# Altium schematic sheet MainDuasRodas.SchDoc
size A4
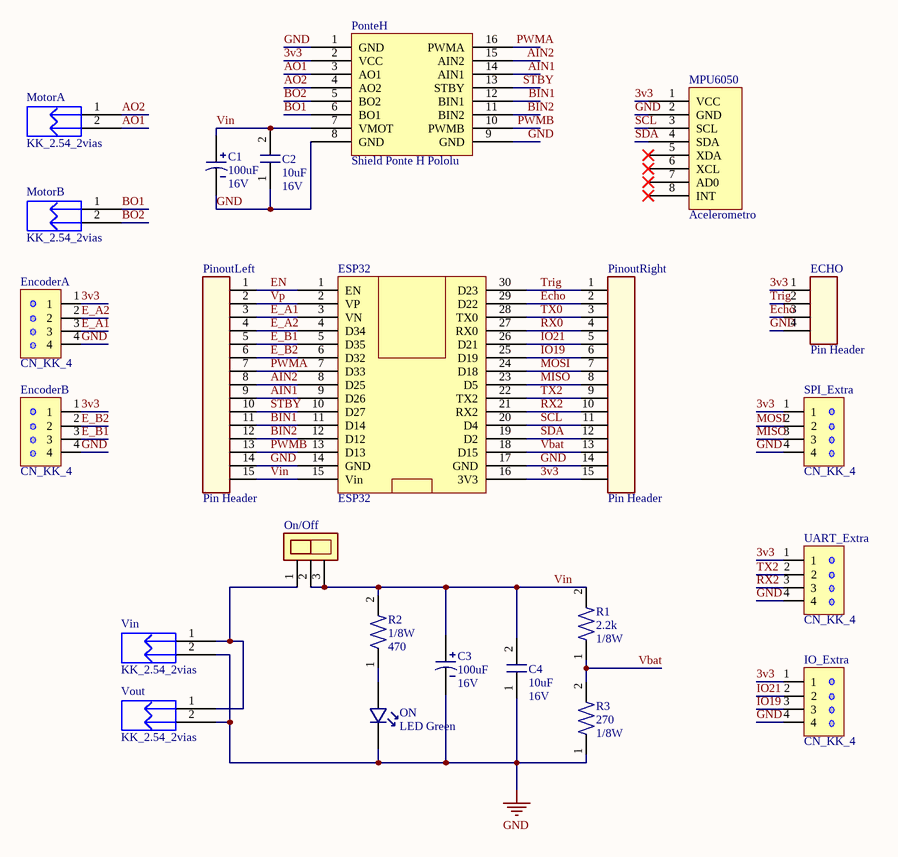
[diagram p0: MainDuasRodas.SchDoc]

## Parts
C1  Capacitance: 100uF  Voltage: 16V  [Cap Elec 100uF/16V]  (hidden comment: Cap Elec 100uF/16V)
C2  Capacitance: 10uF  Voltage: 16V  [CAP 10uF/16V]  (hidden comment: CAP 10uF/16v)
C3  Capacitance: 100uF  Voltage: 16V  [Cap Elec 100uF/16V]  (hidden comment: Cap Elec 100uF/16V)
C4  Capacitance: 10uF  Voltage: 16V  [CAP 10uF/16V]  (hidden comment: CAP 10uF/16v)
ECHO  Pin Header  [Pin Header 4 Ways]
EncoderA  CN_KK_4  [CN_KK_4_5045-4]
EncoderB  CN_KK_4  [CN_KK_4_5045-4]
ESP32  ESP32  [DIP30 - duplicate3]
IO_Extra  CN_KK_4  [CN_KK_4_5045-4]
MotorA  KK_2.54_2vias  [KK_2VIAS_180º]
MotorB  KK_2.54_2vias  [KK_2VIAS_180º]
MPU6050  Acelerometro  [MPU6050]
ON  LED Green  [LED GREEN PTH STAND]
On/Off  SS12D00G4  [SS12D00G4]  (value not drawn)
PinoutLeft  Pin Header  [Pin Header 15 Ways]
PinoutRight  Pin Header  [Pin Header 15 Ways]
PonteH  Shield Ponte H Pololu  [SHIELDMD08AR]
R1  Resistence: 2.2k  Power: 1/8W  [RES SMD 2.2k OHM 1% 1/8W 0805]  (hidden comment: RES 0805)
R2  Power: 1/8W  Resistence: 470  [RES SMD 470OHM 1% 1/8W 0805]  (hidden comment: RES 0805)
R3  Resistence: 270  Power: 1/8W  [RES SMD 270 OHM 1% 1/8W 0805]  (hidden comment: RES 0805)
SPI_Extra  CN_KK_4  [CN_KK_4_5045-4]
UART_Extra  CN_KK_4  [CN_KK_4_5045-4]
Vin  KK_2.54_2vias  [KK_2VIAS_180º]
Vout  KK_2.54_2vias  [KK_2VIAS_180º]

## Nets
GND: C1.1 C2.1 C3.1 C4.1 ECHO.4 EncoderA.4 EncoderB.4 ESP32.14(GND) ESP32.17(GND) IO_Extra.4 MPU6050.2(GND) ON.K PinoutLeft.14 PinoutRight.14 PonteH.1(GND) PonteH.8(GND) PonteH.9(GND) R3.1 SPI_Extra.4 UART_Extra.4 Vin.2 Vout.2
3v3: ECHO.1 EncoderA.1 EncoderB.1 ESP32.16(3V3) IO_Extra.1 MPU6050.1(VCC) PinoutRight.15 PonteH.2(VCC) SPI_Extra.1 UART_Extra.1
AIN1: ESP32.9(D26) PinoutLeft.9 PonteH.14(AIN1)
AIN2: ESP32.8(D25) PinoutLeft.8 PonteH.15(AIN2)
AO1: MotorA.2 PonteH.3(AO1)
AO2: MotorA.1 PonteH.4(AO2)
BIN1: ESP32.11(D14) PinoutLeft.11 PonteH.12(BIN1)
BIN2: ESP32.12(D12) PinoutLeft.12 PonteH.11(BIN2)
BO1: MotorB.1 PonteH.6(BO1)
BO2: MotorB.2 PonteH.5(BO2)
E_A1: EncoderA.3 ESP32.3(VN) PinoutLeft.3
E_A2: EncoderA.2 ESP32.4(D34) PinoutLeft.4
E_B1: EncoderB.3 ESP32.5(D35) PinoutLeft.5
E_B2: EncoderB.2 ESP32.6(D32) PinoutLeft.6
Echo: ECHO.3 ESP32.29(D22) PinoutRight.2
EN: ESP32.1(EN) PinoutLeft.1
IO19: ESP32.25(D19) IO_Extra.3 PinoutRight.6
IO21: ESP32.26(D21) IO_Extra.2 PinoutRight.5
MISO: ESP32.23(D5) PinoutRight.8 SPI_Extra.3
MOSI: ESP32.24(D18) PinoutRight.7 SPI_Extra.2
PWMA: ESP32.7(D33) PinoutLeft.7 PonteH.16(PWMA)
PWMB: ESP32.13(D13) PinoutLeft.13 PonteH.10(PWMB)
RX0: ESP32.27(RX0) PinoutRight.4
RX2: ESP32.21(RX2) PinoutRight.10 UART_Extra.3
SCL: ESP32.20(D4) MPU6050.3(SCL) PinoutRight.11
SDA: ESP32.19(D2) MPU6050.4(SDA) PinoutRight.12
STBY: ESP32.10(D27) PinoutLeft.10 PonteH.13(STBY)
Trig: ECHO.2 ESP32.30(D23) PinoutRight.1
TX0: ESP32.28(TX0) PinoutRight.3
TX2: ESP32.22(TX2) PinoutRight.9 UART_Extra.2
Vbat: ESP32.18(D15) PinoutRight.13 R1.1 R3.2
Vin: C1.2 C2.2 C3.2 C4.2 ESP32.15(Vin) On/Off.2 On/Off.3 PinoutLeft.15 PonteH.7(VMOT) R1.2 R2.2
Vp: ESP32.2(VP) PinoutLeft.2
NetOn/Off_1: On/Off.1 Vin.1 Vout.1
NetON_A: ON.A R2.1

Not connected (* = marked no-connect by the designer): MPU6050 5(XDA)* 6(XCL)* 7(AD0)* 8(INT)*

## Library data of the parts
C1 C3 = Cap Elec 100uF/16V: 100µF 16V Aluminum Electrolytic Capacitors Radial; Manufacturer 1: KEMET; Manufacturer 1 PN: ESK107M016AC3AA; Mouser PN: 80-ESK107M016AC3AA; Digikey PN: 399-6601-ND; ComponentLink1Description: Datasheet; ComponentLink1URL: https://content.kemet.com/datasheets/KEM_A4004_ESK.pdf
C2 C4 = CAP 10uF/16V: 10µF ±10% 16V Ceramic Capacitor X5R 0805 (2012 Metric); Manufacturer 1: Samsung Electro-Mechanics; Manufacturer 1 PN: CL21A106KOQNNWE; ComponentLink1Description: Specification; ComponentLink1URL: http://www.samsungsem.com/kr/support/product-search/mlcc/__icsFiles/afieldfile/2018/07/27/CL21A106KOQNNWE.pdf; Mouser PN: 710-885012107014; Digikey PN: 1276-2894-1-ND
ECHO = Pin Header 4 ways: Connector Header PTH 0.100" (2.54mm); Manufacturer 1: Irwin Inc.; Manufacturer 1 PN: M20-9992046
EncoderA EncoderB IO_Extra SPI_Extra UART_Extra = CN_KK_4: KK_4; Value: ?
MotorA MotorB Vin Vout = KK_2.54_2vias: Conector KK 2.54mm 2 vias; Descrição: Conector KK 3 vias com passo 2.54mm; Encapsulamento: PTH - 180º; Modelo: 2 vias - 180º; Valor: KK 2 vias 180º; Marca: *; Observação: *
MPU6050 = MPU6050
ON = LED Green PTH Stand: Green 527nm LED Indication - Discrete 3.2V Radial; Manufacturer 1: Wurth Electronics Inc.; Manufacturer 1 PN: 151053GS03000; ComponentLink1Description: Datasheet; ComponentLink1URL: https://www.cree.com/led-components/media/documents/C503B-BAS-BAN-BCS-BCN-GAS-GAN-GCS-GCN-1094.pdf; Digikey PN: 732-5020-ND; Mouser PN: 710-151053GS03000
PinoutLeft PinoutRight = Pin Header 15 ways: Connector Header PTH 0.100" (2.54mm); Manufacturer 1: Irwin Inc.; Manufacturer 1 PN: M20-9992046
PonteH = Md08a
R1 = RES 2.2k 1% 1/8W: 2.2 kOhms ±1% 0.125W, 1/8W Chip Resistor 0805 (2012 Metric) Moisture Resistant Thick Film; Manufacturer 1: Yageo; Manufacturer 1 PN: RC0805FR-072K2L; Digikey PN: 311-2.20KCRCT-ND; ComponentLink1Description: Datasheet; ComponentLink1URL: http://www.yageo.com/documents/recent/PYu-RC_Group_51_RoHS_L_9.pdf; Mouser PN: 603-RC0805FR-072K2L
R2 = RES 470 1% 1/8W: 470 Ohms ±1% 0.125W, 1/8W Chip Resistor 0805 (2012 Metric) Moisture Resistant Thick Film; Manufacturer 1: Yageo; Manufacturer 1 PN: RC0805FR-07470RL; ComponentLink1Description: Datasheet; ComponentLink1URL: http://www.yageo.com/documents/recent/PYu-RC_Group_51_RoHS_L_9.pdf; Digikey PN: 311-10.0KCRCT-ND; Mouser PN: 603-RC0805FR-07470RL
R3 = RES 270 1% 1/8W: 270Ohms ±1% 0.125W, 1/8W Chip Resistor 0805 (2012 Metric) Moisture Resistant Thick Film; Manufacturer 1: Yageo; Manufacturer 1 PN: RC0805FR-07270RL; Digikey PN: 311-270CRCT-ND; ComponentLink1Description: Datasheet; ComponentLink1URL: http://www.yageo.com/documents/recent/PYu-RC_Group_51_RoHS_L_9.pdf; Mouser PN: 603-RC0805FR-07270RL